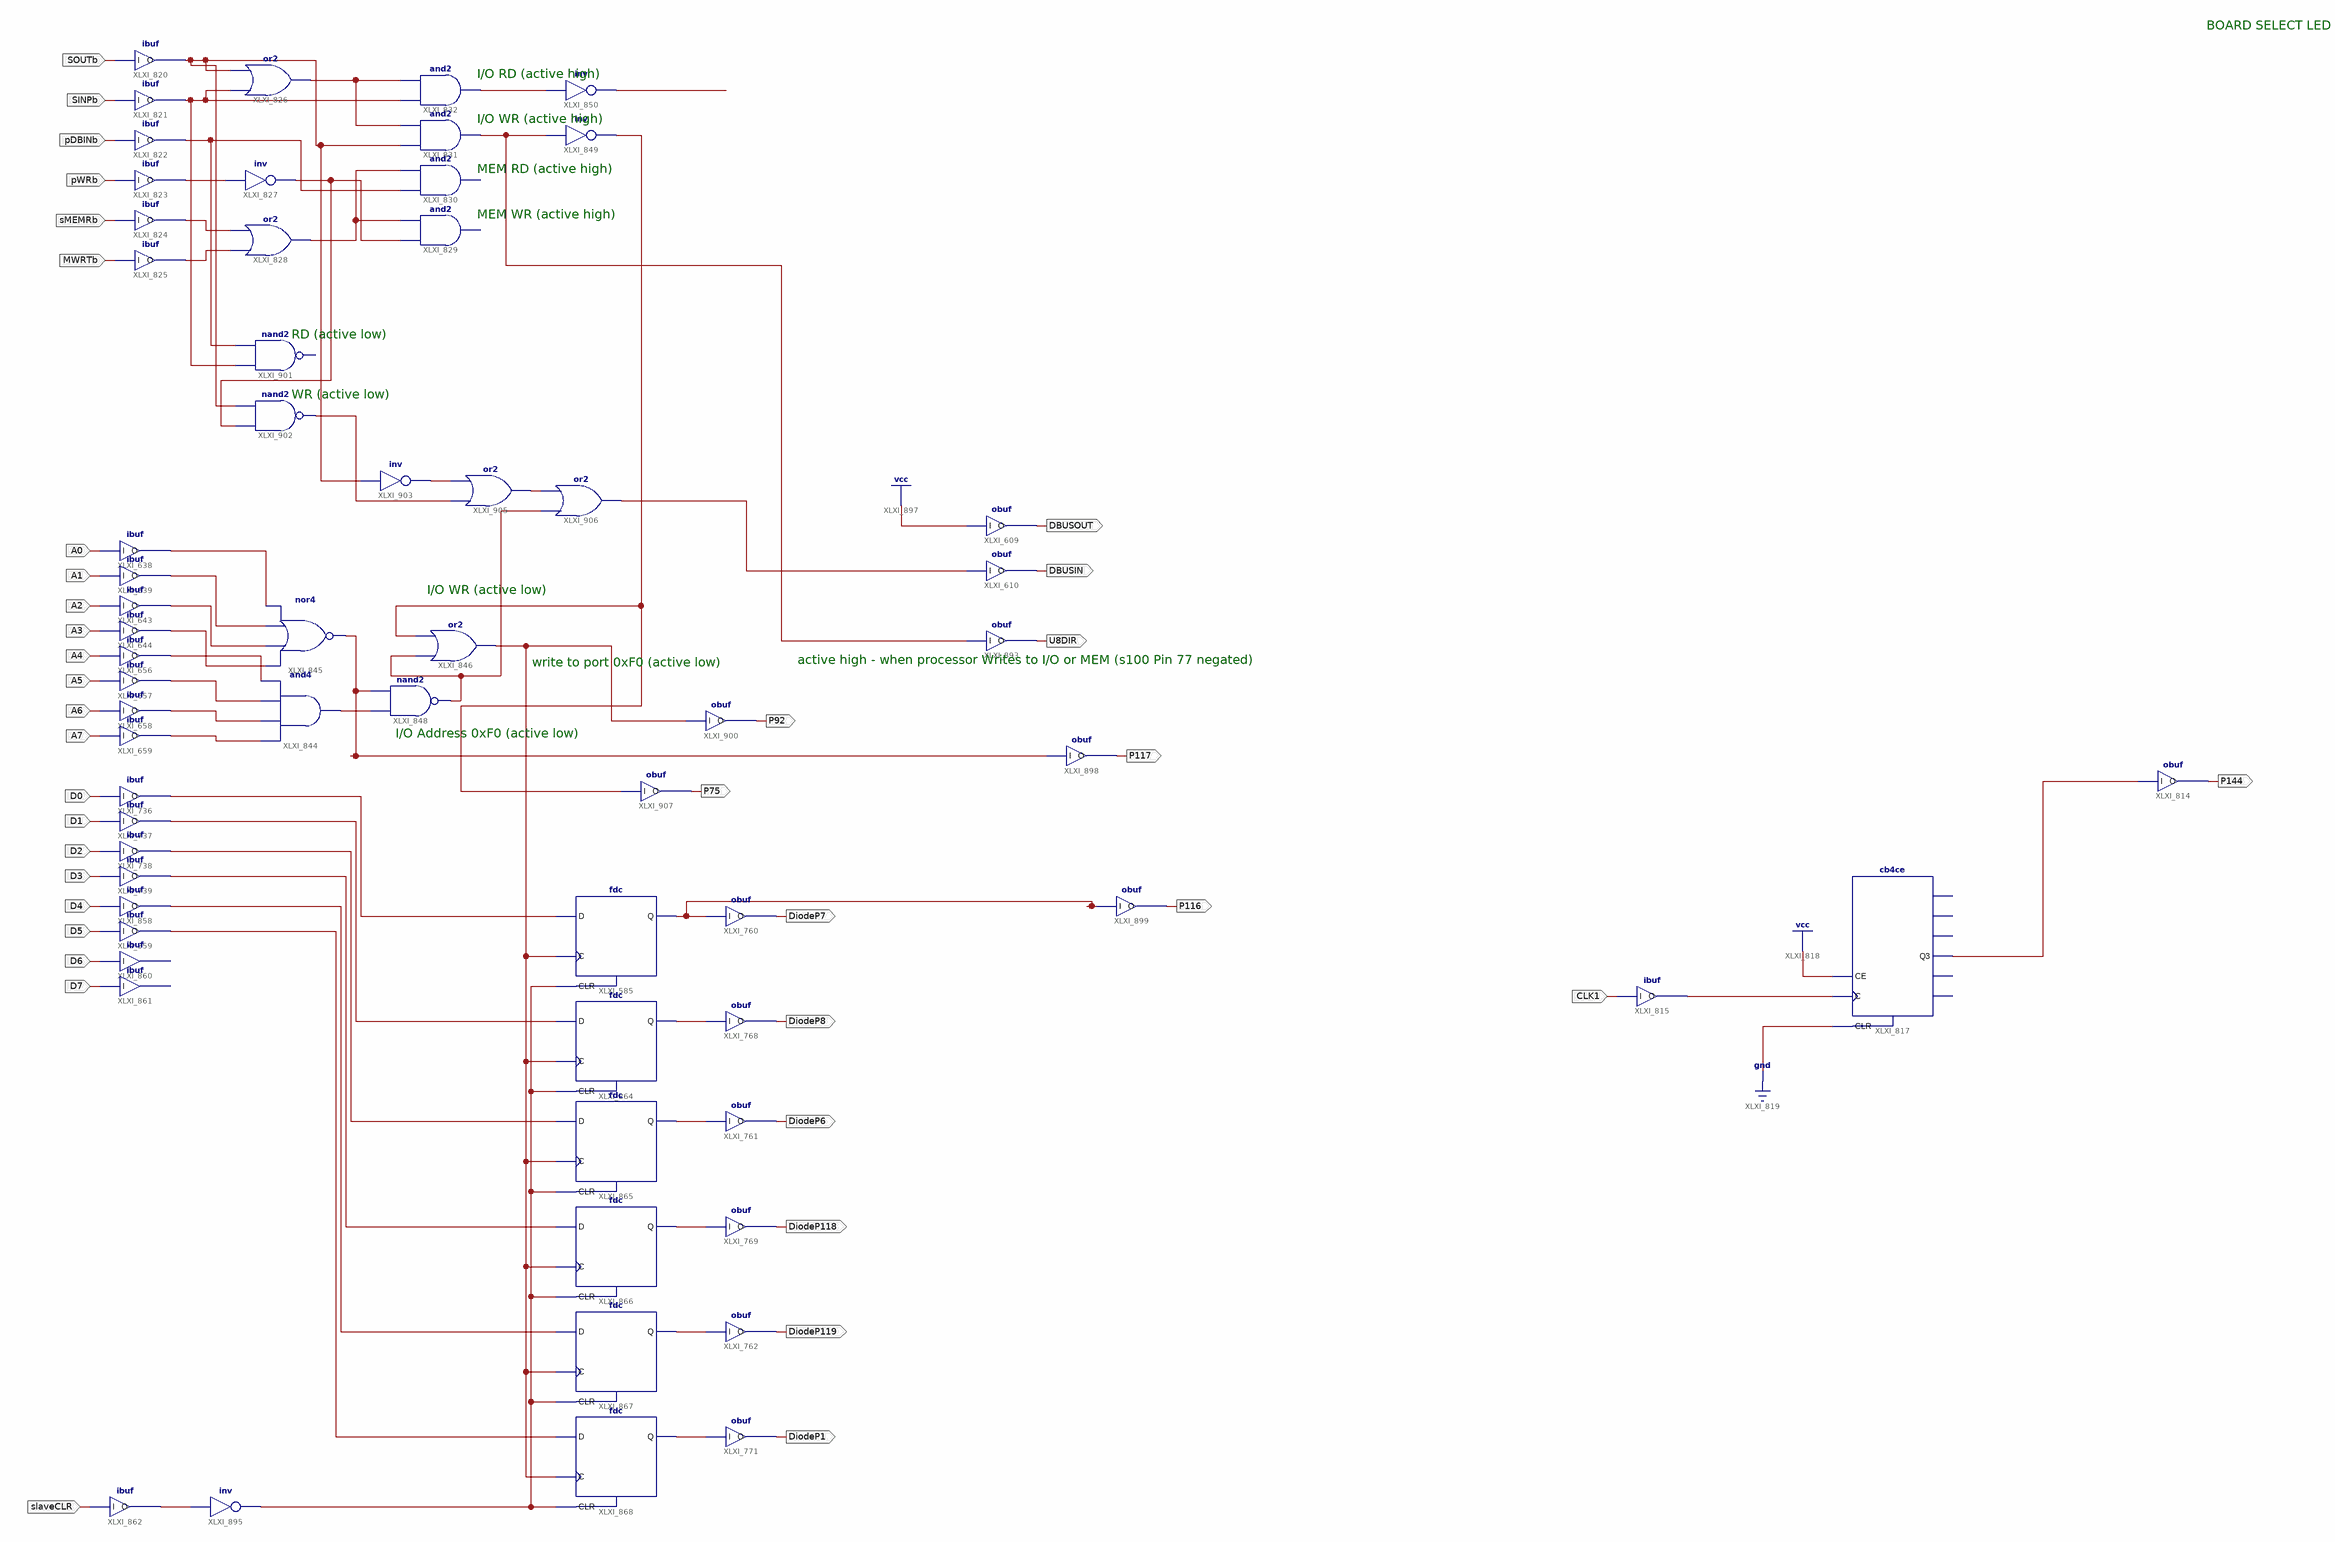
[diagram p0: schematic sheet 1]
// Xilinx ISE schematic U30v2.sch (spartan6) as structural Verilog: 64 symbols, 38 ports
module U30v2 (
  input  CLK1,
  input  SOUTb,
  input  SINPb,
  input  pDBINb,
  input  pWRb,
  input  sMEMRb,
  input  MWRTb,
  input  A0,
  input  A1,
  input  A2,
  input  A3,
  input  A4,
  input  A5,
  input  A6,
  input  A7,
  input  D0,
  input  D1,
  input  D2,
  input  D3,
  input  D4,
  input  D5,
  input  D6,
  input  D7,
  input  slaveCLR,
  output P144,
  output DBUSOUT,
  output DBUSIN,
  output DiodeP7,
  output DiodeP8,
  output DiodeP6,
  output DiodeP118,
  output DiodeP119,
  output DiodeP1,
  output U8DIR,
  output P92,
  output P117,
  output P116,
  output P75
);

  wire XLXN_1123, XLXN_1124, XLXN_1131, XLXN_1132, XLXN_1134, XLXN_1135, XLXN_1137, XLXN_1138, XLXN_1151,
       XLXN_1152, XLXN_1153, XLXN_1154, XLXN_1155, XLXN_1156, XLXN_1157, XLXN_1158, XLXN_1160, XLXN_1161,
       XLXN_1162, XLXN_1200, XLXN_1202, XLXN_1203, XLXN_1207, XLXN_1208, XLXN_1209, XLXN_1210, XLXN_1211,
       XLXN_1212, XLXN_1214, XLXN_1220, XLXN_1235, XLXN_1244, XLXN_1245, XLXN_1246, XLXN_1248, XLXN_1250,
       XLXN_1251, XLXN_1252, XLXN_1255, XLXN_1256, XLXN_1257, XLXN_1263, XLXN_1264, XLXN_1265, XLXN_1269;

  obuf XLXI_814 (.I(XLXN_1124), .O(P144));
  cb4ce XLXI_817 (.C(XLXN_1123), .CE(1'b1), .CLR(1'b0), .Q3(XLXN_1124));  // open: CEO, Q0, Q1, Q2, TC
  ibuf XLXI_815 (.I(CLK1), .O(XLXN_1123));
  ibuf XLXI_820 (.I(SOUTb), .O(XLXN_1132));
  ibuf XLXI_821 (.I(SINPb), .O(XLXN_1246));
  ibuf XLXI_822 (.I(pDBINb), .O(XLXN_1245));
  ibuf XLXI_823 (.I(pWRb), .O(XLXN_1131));
  ibuf XLXI_824 (.I(sMEMRb), .O(XLXN_1134));
  ibuf XLXI_825 (.I(MWRTb), .O(XLXN_1135));
  or XLXI_826 (XLXN_1137, XLXN_1246, XLXN_1132);
  not XLXI_827 (XLXN_1248, XLXN_1131);
  or XLXI_828 (XLXN_1138, XLXN_1135, XLXN_1134);
  // and2 XLXI_829 has open pins: I0=XLXN_1248, I1=XLXN_1138, O=open
  // and2 XLXI_830 has open pins: I0=XLXN_1245, I1=XLXN_1138, O=open
  and XLXI_831 (XLXN_1244, XLXN_1132, XLXN_1137);
  and XLXI_832 (XLXN_1162, XLXN_1246, XLXN_1137);
  ibuf XLXI_638 (.I(A0), .O(XLXN_1151));
  ibuf XLXI_639 (.I(A1), .O(XLXN_1152));
  ibuf XLXI_643 (.I(A2), .O(XLXN_1153));
  ibuf XLXI_644 (.I(A3), .O(XLXN_1154));
  ibuf XLXI_656 (.I(A4), .O(XLXN_1155));
  ibuf XLXI_657 (.I(A5), .O(XLXN_1156));
  ibuf XLXI_658 (.I(A6), .O(XLXN_1157));
  ibuf XLXI_659 (.I(A7), .O(XLXN_1158));
  and XLXI_844 (XLXN_1269, XLXN_1158, XLXN_1157, XLXN_1156, XLXN_1155);
  nor XLXI_845 (XLXN_1160, XLXN_1154, XLXN_1153, XLXN_1152, XLXN_1151);
  or XLXI_846 (XLXN_1252, XLXN_1161, XLXN_1257);
  nand XLXI_848 (XLXN_1161, XLXN_1269, XLXN_1160);
  not XLXI_849 (XLXN_1257, XLXN_1244);
  not XLXI_850 (XLXN_1235, XLXN_1162);
  obuf XLXI_610 (.I(XLXN_1255), .O(DBUSIN));
  obuf XLXI_609 (.I(1'b1), .O(DBUSOUT));
  ibuf XLXI_736 (.I(D0), .O(XLXN_1207));
  ibuf XLXI_737 (.I(D1), .O(XLXN_1208));
  ibuf XLXI_738 (.I(D2), .O(XLXN_1209));
  ibuf XLXI_739 (.I(D3), .O(XLXN_1210));
  ibuf XLXI_858 (.I(D4), .O(XLXN_1211));
  ibuf XLXI_859 (.I(D5), .O(XLXN_1212));
  ibuf XLXI_860 (.I(D6));  // open: O
  ibuf XLXI_861 (.I(D7));  // open: O
  fdc XLXI_585 (.C(XLXN_1252), .CLR(XLXN_1220), .D(XLXN_1207), .Q(XLXN_1263));
  fdc XLXI_864 (.C(XLXN_1252), .CLR(XLXN_1220), .D(XLXN_1208), .Q(XLXN_1264));
  fdc XLXI_865 (.C(XLXN_1252), .CLR(XLXN_1220), .D(XLXN_1209), .Q(XLXN_1203));
  fdc XLXI_866 (.C(XLXN_1252), .CLR(XLXN_1220), .D(XLXN_1210), .Q(XLXN_1202));
  fdc XLXI_867 (.C(XLXN_1252), .CLR(XLXN_1220), .D(XLXN_1211), .Q(XLXN_1265));
  fdc XLXI_868 (.C(XLXN_1252), .CLR(XLXN_1220), .D(XLXN_1212), .Q(XLXN_1200));
  obuf XLXI_760 (.I(XLXN_1263), .O(DiodeP7));
  obuf XLXI_768 (.I(XLXN_1264), .O(DiodeP8));
  obuf XLXI_761 (.I(XLXN_1203), .O(DiodeP6));
  obuf XLXI_769 (.I(XLXN_1202), .O(DiodeP118));
  obuf XLXI_762 (.I(XLXN_1265), .O(DiodeP119));
  obuf XLXI_771 (.I(XLXN_1200), .O(DiodeP1));
  obuf XLXI_893 (.I(XLXN_1244), .O(U8DIR));
  ibuf XLXI_862 (.I(slaveCLR), .O(XLXN_1214));
  not XLXI_895 (XLXN_1220, XLXN_1214);
  obuf XLXI_900 (.I(XLXN_1252), .O(P92));
  obuf XLXI_898 (.I(XLXN_1160), .O(P117));
  // nand2 XLXI_901 has open pins: I0=XLXN_1246, I1=XLXN_1245, O=open
  nand XLXI_902 (XLXN_1251, XLXN_1248, XLXN_1132);
  not XLXI_903 (XLXN_1250, XLXN_1132);
  or XLXI_905 (XLXN_1256, XLXN_1251, XLXN_1250);
  or XLXI_906 (XLXN_1255, XLXN_1161, XLXN_1256);
  obuf XLXI_899 (.I(XLXN_1263), .O(P116));
  obuf XLXI_907 (.I(XLXN_1257), .O(P75));

  // Notes on the sheet:
  //   BOARD SELECT LED
  //   I/O RD (active high)
  //   I/O WR (active high)
  //   MEM RD (active high)
  //   MEM WR (active high)
  //   RD (active low)
  //   WR (active low)
  //   I/O WR (active low)
  //   active high - when processor Writes to I/O or MEM (s100 Pin 77 negated)
  //   write to port 0xF0 (active low)
  //   I/O Address 0xF0 (active low)
endmodule
